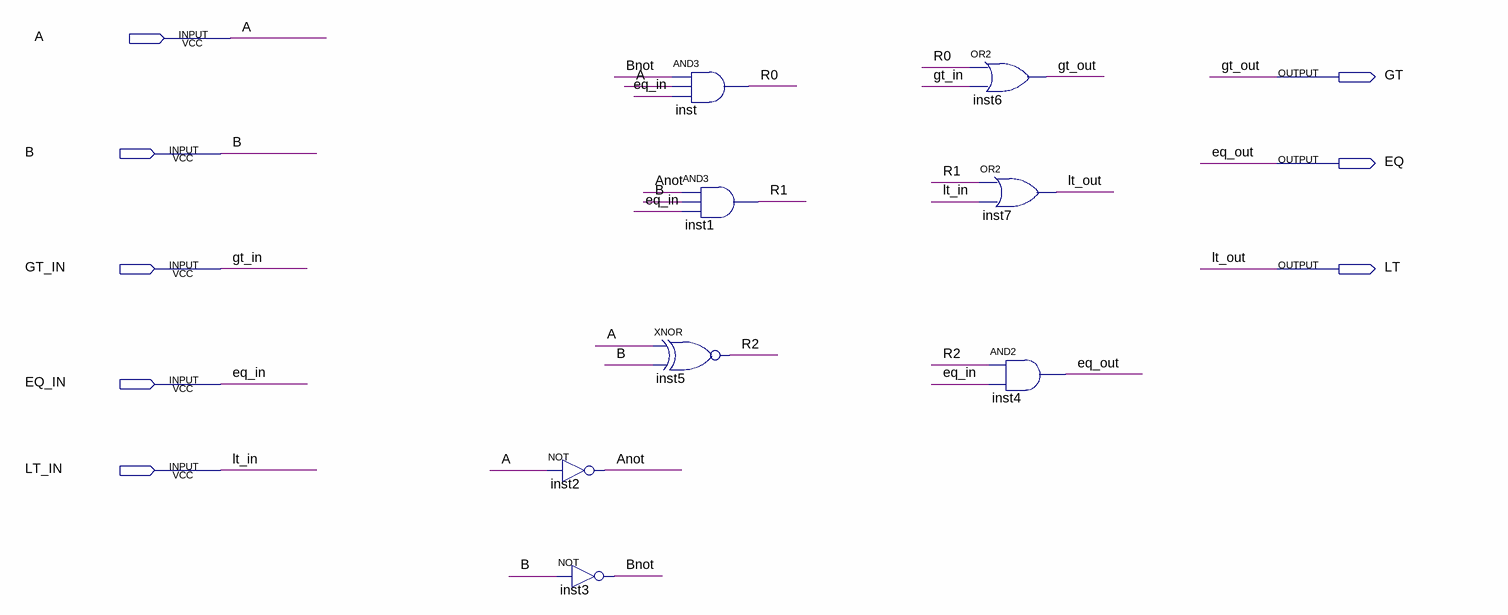
[diagram p0: schematic sheet]
// Quartus schematic CMP_1bit_alter.bdf as structural Verilog: 8 symbols, 8 pins
module CMP_1bit_alter (
  input  A,
  input  B,
  input  GT_IN,
  input  EQ_IN,
  input  LT_IN,
  output GT,
  output EQ,
  output LT
);

  wire Anot, Bnot, R0, R1, R2;

  not inst2 (Anot, A);
  not inst3 (Bnot, B);
  and inst (R0, Bnot, A, EQ_IN);
  and inst1 (R1, Anot, B, EQ_IN);
  xnor inst5 (R2, A, B);
  or inst6 (GT, R0, GT_IN);
  or inst7 (LT, R1, LT_IN);
  and inst4 (EQ, R2, EQ_IN);

  // Other names for the same wires on the sheet: eq_out = EQ; gt_out = GT; lt_out = LT
endmodule
